# Altium project nrf24l01_mboard.PrjPCB
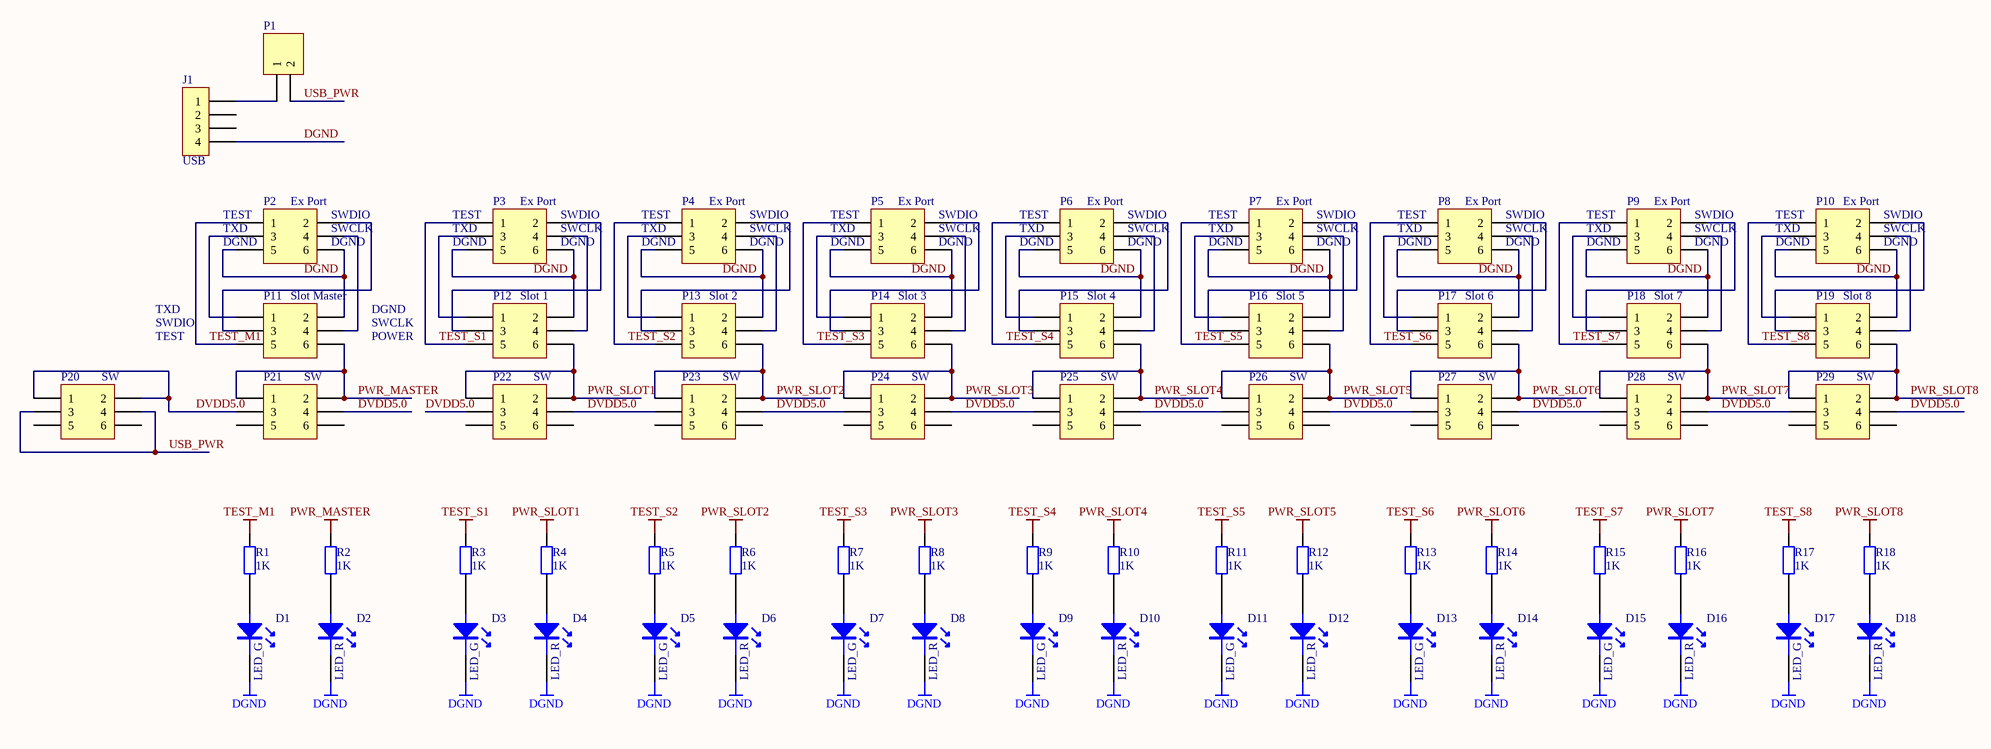
[diagram p0: nrf24l01_mboard.SchDoc]
1 sheet, 66 parts. Net scope: global (net labels, ports and power ports of the same name join across sheets).
Board file: nrf24l01_mboard.PcbDoc

## Sheet nrf24l01_mboard.SchDoc
size A3

### Parts
D1  LED_G  [LED-0603R]
D2  LED_R  [LED-0603R]
D3  LED_G  [LED-0603R]
D4  LED_R  [LED-0603R]
D5  LED_G  [LED-0603R]
D6  LED_R  [LED-0603R]
D7  LED_G  [LED-0603R]
D8  LED_R  [LED-0603R]
D9  LED_G  [LED-0603R]
D10  LED_R  [LED-0603R]
D11  LED_G  [LED-0603R]
D12  LED_R  [LED-0603R]
D13  LED_G  [LED-0603R]
D14  LED_R  [LED-0603R]
D15  LED_G  [LED-0603R]
D16  LED_R  [LED-0603R]
D17  LED_G  [LED-0603R]
D18  LED_R  [LED-0603R]
J1  USB  [USB-MINIB]
P1  (no value)  [HDR1X2]
P2  Ex Port  [IDC6]
P3  Ex Port  [IDC6]
P4  Ex Port  [IDC6]
P5  Ex Port  [IDC6]
P6  Ex Port  [IDC6]
P7  Ex Port  [IDC6]
P8  Ex Port  [IDC6]
P9  Ex Port  [IDC6]
P10  Ex Port  [IDC6]
P11  Slot Master  [S-8M-2.54-5 6P]
P12  Slot 1  [S-8M-2.54-5 6P]
P13  Slot 2  [S-8M-2.54-5 6P]
P14  Slot 3  [S-8M-2.54-5 6P]
P15  Slot 4  [S-8M-2.54-5 6P]
P16  Slot 5  [S-8M-2.54-5 6P]
P17  Slot 6  [S-8M-2.54-5 6P]
P18  Slot 7  [S-8M-2.54-5 6P]
P19  Slot 8  [S-8M-2.54-5 6P]
P20  SW  [SW-7x7]
P21  SW  [SW-7x7]
P22  SW  [SW-7x7]
P23  SW  [SW-7x7]
P24  SW  [SW-7x7]
P25  SW  [SW-7x7]
P26  SW  [SW-7x7]
P27  SW  [SW-7x7]
P28  SW  [SW-7x7]
P29  SW  [SW-7x7]
R1  1K  [1608(0603R)]
R2  1K  [1608(0603R)]
R3  1K  [1608(0603R)]
R4  1K  [1608(0603R)]
R5  1K  [1608(0603R)]
R6  1K  [1608(0603R)]
R7  1K  [1608(0603R)]
R8  1K  [1608(0603R)]
R9  1K  [1608(0603R)]
R10  1K  [1608(0603R)]
R11  1K  [1608(0603R)]
R12  1K  [1608(0603R)]
R13  1K  [1608(0603R)]
R14  1K  [1608(0603R)]
R15  1K  [1608(0603R)]
R16  1K  [1608(0603R)]
R17  1K  [1608(0603R)]
R18  1K  [1608(0603R)]

### Nets
DGND: D1.K D2.K D3.K D4.K D5.K D6.K D7.K D8.K D9.K D10.K D11.K D12.K D13.K D14.K D15.K D16.K D17.K D18.K J1.4 P2.5 P2.6 P3.5 P3.6 P4.5 P4.6 P5.5 P5.6 P6.5 P6.6 P7.5 P7.6 P8.5 P8.6 P9.5 P9.6 P10.5 P10.6 P11.2 P12.2 P13.2 P14.2 P15.2 P16.2 P17.2 P18.2 P19.2
PWR_MASTER: P11.6 P21.1 P21.2 R2.1
PWR_SLOT1: P12.6 P22.1 P22.2 R4.1
PWR_SLOT2: P13.6 P23.1 P23.2 R6.1
PWR_SLOT3: P14.6 P24.1 P24.2 R8.1
PWR_SLOT4: P15.6 P25.1 P25.2 R10.1
PWR_SLOT5: P16.6 P26.1 P26.2 R12.1
PWR_SLOT6: P17.6 P27.1 P27.2 R14.1
PWR_SLOT7: P18.6 P28.1 P28.2 R16.1
PWR_SLOT8: P19.6 P29.1 P29.2 R18.1
TEST_M1: P2.1 P11.5 R1.1
TEST_S1: P3.1 P12.5 R3.1
TEST_S2: P4.1 P13.5 R5.1
TEST_S3: P5.1 P14.5 R7.1
TEST_S4: P6.1 P15.5 R9.1
TEST_S5: P7.1 P16.5 R11.1
TEST_S6: P8.1 P17.5 R13.1
TEST_S7: P9.1 P18.5 R15.1
TEST_S8: P10.1 P19.5 R17.1
DVDD5.0: P20.1 P20.2 P21.3 P21.4 P22.3 P22.4 P23.3 P23.4 P24.3 P24.4 P25.3 P25.4 P26.3 P26.4 P27.3 P27.4 P28.3 P28.4 P29.3 P29.4
USB_PWR: P1.2 P20.3 P20.4
NetD1_A: D1.A R1.2
NetD2_A: D2.A R2.2
NetD3_A: D3.A R3.2
NetD4_A: D4.A R4.2
NetD5_A: D5.A R5.2
NetD6_A: D6.A R6.2
NetD7_A: D7.A R7.2
NetD8_A: D8.A R8.2
NetD9_A: D9.A R9.2
NetD10_A: D10.A R10.2
NetD11_A: D11.A R11.2
NetD12_A: D12.A R12.2
NetD13_A: D13.A R13.2
NetD14_A: D14.A R14.2
NetD15_A: D15.A R15.2
NetD16_A: D16.A R16.2
NetD17_A: D17.A R17.2
NetD18_A: D18.A R18.2
NetJ1_1: J1.1 P1.1
NetP2_2: P2.2 P11.3
NetP2_3: P2.3 P11.1
NetP2_4: P2.4 P11.4
NetP3_2: P3.2 P12.3
NetP3_3: P3.3 P12.1
NetP3_4: P3.4 P12.4
NetP4_2: P4.2 P13.3
NetP4_3: P4.3 P13.1
NetP4_4: P4.4 P13.4
NetP5_2: P5.2 P14.3
NetP5_3: P5.3 P14.1
NetP5_4: P5.4 P14.4
NetP6_2: P6.2 P15.3
NetP6_3: P6.3 P15.1
NetP6_4: P6.4 P15.4
NetP7_2: P7.2 P16.3
NetP7_3: P7.3 P16.1
NetP7_4: P7.4 P16.4
NetP8_2: P8.2 P17.3
NetP8_3: P8.3 P17.1
NetP8_4: P8.4 P17.4
NetP9_2: P9.2 P18.3
NetP9_3: P9.3 P18.1
NetP9_4: P9.4 P18.4
NetP10_2: P10.2 P19.3
NetP10_3: P10.3 P19.1
NetP10_4: P10.4 P19.4

Not connected (* = marked no-connect by the designer): J1 2 3; P20 5 6; P21 5 6; P22 5 6; P23 5 6; P24 5 6; P25 5 6; P26 5 6; P27 5 6; P28 5 6; P29 5 6

### Notes on the sheet
- (near P2) TXD
- (near P2) TEST
- (near P2) SWCLK
- (near P2) SWDIO
- (near P3) TXD
- (near P3) TEST
- (near P3) SWCLK
- (near P3) SWDIO
- (near P4) TXD
- (near P4) TEST
- (near P4) SWCLK
- (near P4) SWDIO
- (near P5) TXD
- (near P5) TEST
- (near P5) SWCLK
- (near P5) SWDIO
- (near P6) TXD
- (near P6) TEST
- (near P6) SWCLK
- (near P6) SWDIO
- (near P7) TXD
- (near P7) TEST
- (near P7) SWCLK
- (near P7) SWDIO
- (near P8) TXD
- (near P8) TEST
- (near P8) SWCLK
- (near P8) SWDIO
- (near P9) TXD
- (near P9) TEST
- (near P9) SWCLK
- (near P9) SWDIO
- (near P10) TXD
- (near P10) TEST
- (near P10) SWCLK
- (near P10) SWDIO
- (near P2) DGND
- (near P3) DGND
- (near P4) DGND
- (near P5) DGND
- (near P6) DGND
- (near P7) DGND
- (near P8) DGND
- (near P9) DGND
- (near P10) DGND
- TXD
- SWDIO
- TEST
- DGND
- SWCLK
- POWER

### Library data of the parts
D1-D18 = LED
J1 = CON4: Connector
P1 = Header 2: Header, 2-Pin; LatestRevisionDate: 17-Jul-2002; LatestRevisionNote: Re-released for DXP Platform.; Publisher: Altium Limited
P2-P29 = Header 3X2: Header, 3-Pin, Dual row; LatestRevisionDate: 17-Jul-2002; LatestRevisionNote: Re-released for DXP Platform.; Publisher: Altium Limited
R1-R18 = Res2: Resistor; Published: 8-Jun-2000; LatestRevisionDate: 17-Jul-2002; LatestRevisionNote: Re-released for DXP Platform.; PackageReference: AXIAL-0.4; Publisher: Altium Limited; Value: 1K